# Altium schematic sheet main.SchDoc
size OrCAD A; DrawnBy: Van Tuan Ngo; Organization: PIF Club; Address1: HCMUT,; Address2: Ly Thuong Kiet St.,; Address3: District 10, HCM, VN; DocumentNumber: 1; Revision: 1.0.0; SheetNumber: 1; SheetTotal: 4; Project: RTLS
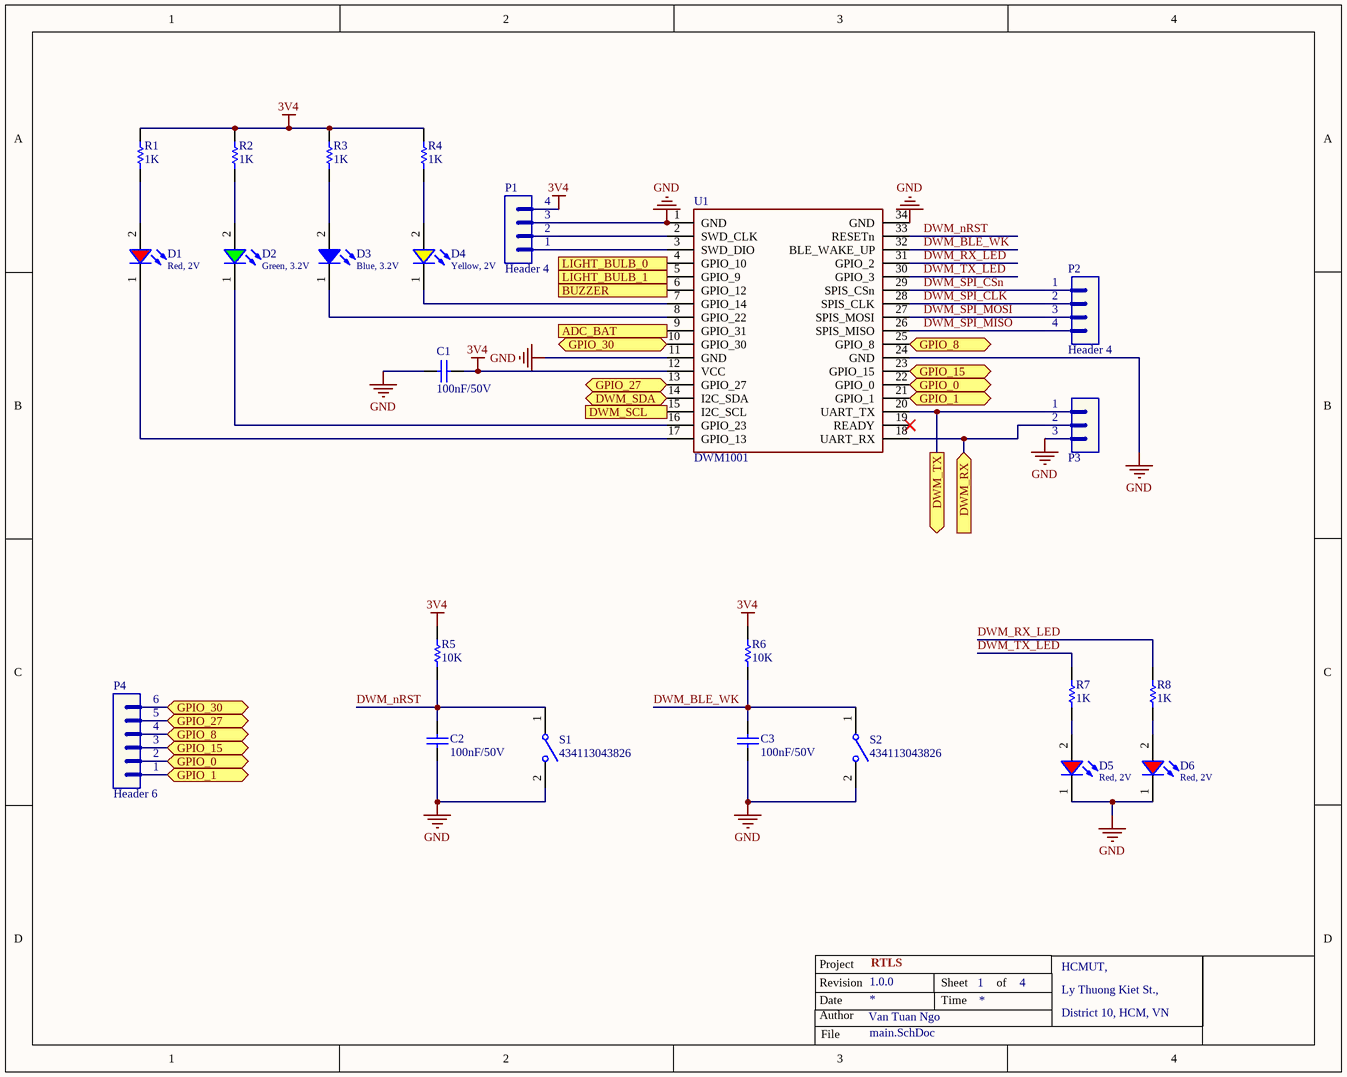
[diagram p0: main.SchDoc]

## Parts
C1  value 100nF/50V  [CAP-SM-0805]  (hidden comment: Cap-100nF-50V-0805)
C2  value 100nF/50V  [CAP-SM-0805]  (hidden comment: Cap-100nF-50V-0805)
C3  value 100nF/50V  [CAP-SM-0805]  (hidden comment: Cap-100nF-50V-0805)
D1  Red, 2V  [WL-SMCW_0805]
D2  Green, 3.2V  [WL-SMCW_0805]
D3  Blue, 3.2V  [WL-SMCW_0805]
D4  Yellow, 2V  [WL-SMCW_0805]
D5  Red, 2V  [WL-SMCW_0805]
D6  Red, 2V  [WL-SMCW_0805]
P1  Header 4  [JP4]
P2  Header 4  [JP4]
P3  Header 3  [JP3]  (value not drawn)
P4  Header 6  [JP6]
R1  value 1K  [RES-SM-0805]  (hidden comment: Res-1K-0805)
R2  value 1K  [RES-SM-0805]  (hidden comment: Res-1K-0805)
R3  value 1K  [RES-SM-0805]  (hidden comment: Res-1K-0805)
R4  value 1K  [RES-SM-0805]  (hidden comment: Res-1K-0805)
R5  value 10K  [RES-SM-0805]  (hidden comment: Res-10k-0805)
R6  value 10K  [RES-SM-0805]  (hidden comment: Res-10k-0805)
R7  value 1K  [RES-SM-0805]  (hidden comment: Res-1K-0805)
R8  value 1K  [RES-SM-0805]  (hidden comment: Res-1K-0805)
S1  434113043826  [434113043826]
S2  434113043826  [434113043826]
U1  DWM1001  [DWM1001]

## Ports
ADC_BAT (in), BUZZER (out), DWM_RX (in), DWM_SCL (out), DWM_SDA (bidir), DWM_TX (out), GPIO_0 (bidir), GPIO_1 (bidir), GPIO_8 (bidir), GPIO_15 (bidir), GPIO_27 (bidir), GPIO_30 (bidir), LIGHT_BULB_0 (out), LIGHT_BULB_1 (out)

## Nets
3V4: C1.2 P1.4 R1.1 R2.1 R3.1 R4.1 R5.2 R6.2 U1.12(VCC)
GND: C1.1 C2.1 C3.1 D5.1(K) D6.1(K) P1.3 P3.3 S1.2 S2.2 U1.1(GND) U1.11(GND) U1.24(GND) U1.34(GND)
ADC_BAT: U1.9(GPIO_31) ; port ADC_BAT
BUZZER: U1.6(GPIO_12) ; port BUZZER
DWM_BLE_WK: C3.2 R6.1 S2.1 U1.32(BLE_WAKE_UP)
DWM_nRST: C2.2 R5.1 S1.1 U1.33(RESETn)
DWM_RX: P3.2 U1.18(UART_RX) ; port DWM_RX
DWM_RX_LED: R8.1 U1.31(GPIO_2)
DWM_SCL: U1.15(I2C_SCL) ; port DWM_SCL
DWM_SDA: U1.14(I2C_SDA) ; port DWM_SDA
DWM_SPI_CLK: P2.2 U1.28(SPIS_CLK)
DWM_SPI_CSn: P2.1 U1.29(SPIS_CSn)
DWM_SPI_MISO: P2.4 U1.26(SPIS_MISO)
DWM_SPI_MOSI: P2.3 U1.27(SPIS_MOSI)
DWM_TX: P3.1 U1.20(UART_TX) ; port DWM_TX
DWM_TX_LED: R7.1 U1.30(GPIO_3)
GPIO_0: P4.2 U1.22(GPIO_0) ; port GPIO_0
GPIO_1: P4.1 U1.21(GPIO_1) ; port GPIO_1
GPIO_8: P4.4 U1.25(GPIO_8) ; port GPIO_8
GPIO_15: P4.3 U1.23(GPIO_15) ; port GPIO_15
GPIO_27: P4.5 U1.13(GPIO_27) ; port GPIO_27
GPIO_30: P4.6 U1.10(GPIO_30) ; port GPIO_30
LIGHT_BULB_0: U1.4(GPIO_10) ; port LIGHT_BULB_0
LIGHT_BULB_1: U1.5(GPIO_9) ; port LIGHT_BULB_1
NetD1_1: D1.1(K) U1.17(GPIO_13)
NetD1_2: D1.2(A) R1.2
NetD2_1: D2.1(K) U1.16(GPIO_23)
NetD2_2: D2.2(A) R2.2
NetD3_1: D3.1(K) U1.8(GPIO_22)
NetD3_2: D3.2(A) R3.2
NetD4_1: D4.1(K) U1.7(GPIO_14)
NetD4_2: D4.2(A) R4.2
NetD5_2: D5.2(A) R7.2
NetD6_2: D6.2(A) R8.2
NetP1_1: P1.1 U1.3(SWD_DIO)
NetP1_2: P1.2 U1.2(SWD_CLK)

Not connected (* = marked no-connect by the designer): U1 19(READY)*

## Notes on the sheet
- Project
- Revision
- Date
- Author
- Sheet
- Time
- of
- File

## Library data of the parts
C1-C3 = Cap-100nF-50V-0805: CAP CER 0.1UF 50V Y5V 0805; Manufacturer: Samsung Electro-Mechanics; Manufacturer Part Number: CL21F104ZBCNNNC; Local Supplier: thegioiic; Local Supplier Link: https://www.thegioiic.com/products/tu-gom-0805-100nf-0-1uf-50v; Supplier 1: Digikey; Supplier 1 Part Number: 1276-1007-1-ND; Supplier 1 Link: https://www.digikey.com/product-detail/en/samsung-electro-mechanics/CL21F104ZBCNNNC/1276-1007-1-ND/3889093
D1 D5 D6 = 150080RS75000: WL-SMCW SMT Mono-color Chip LED Waterclear, size 0805, Red, 2V, 140deg; Chip Technology: AlInGaP; Dominant Wavelength typ.: 625nm; Luminous Intensity typ.: 150mcd; Peak Wavelength typ.: 630nm; Viewing Angle: 140deg; ComponentLink1Description: Manufacturer; ComponentLink1URL: http://www.we-online.de; ComponentLink2URL: https://www.we-online.com/catalog/datasheet/150080RS75000.pdf; ComponentLink2Description: Datasheet; Forward Voltage typ.: 2V; Emitting Color: Red; Mounting Technology: SMT; Operating Temperature: -40 to +85degC; Published Date: December 2019; Part Number: 150080RS75000; Packaging: Tape and Reel; Size: 0805; Publisher: Wurth Elektronik
D2 = 150080GS75000: WL-SMCW SMT Mono-color Chip LED Waterclear, size 0805, Green, 3.2V, 140deg; Chip Technology: InGaN; Dominant Wavelength typ.: 525nm; Luminous Intensity typ.: 450mcd; Peak Wavelength typ.: 515nm; Viewing Angle: 140deg; ComponentLink1Description: Manufacturer; ComponentLink1URL: http://www.we-online.de; ComponentLink2URL: https://www.we-online.com/catalog/datasheet/150080GS75000.pdf; ComponentLink2Description: Datasheet; Forward Voltage typ.: 3.2V; Emitting Color: Green; Mounting Technology: SMT; Operating Temperature: -40 to +85degC; Published Date: December 2019; Part Number: 150080GS75000; Packaging: Tape and Reel; Size: 0805; Publisher: Wurth Elektronik
D3 = 150080BS75000: WL-SMCW SMT Mono-color Chip LED Waterclear, size 0805, Blue, 3.2V, 140deg; Chip Technology: InGaN; Dominant Wavelength typ.: 470nm; Luminous Intensity typ.: 145mcd; Peak Wavelength typ.: 465nm; Viewing Angle: 140deg; ComponentLink1Description: Manufacturer; ComponentLink1URL: http://www.we-online.de; ComponentLink2URL: https://www.we-online.com/catalog/datasheet/150080BS75000.pdf; ComponentLink2Description: Datasheet; Forward Voltage typ.: 3.2V; Emitting Color: Blue; Mounting Technology: SMT; Operating Temperature: -40 to +85degC; Published Date: December 2019; Part Number: 150080BS75000; Packaging: Tape and Reel; Size: 0805; Publisher: Wurth Elektronik
D4 = 150080YS75000: WL-SMCW SMT Mono-color Chip LED Waterclear, size 0805, Yellow, 2V, 140deg; Chip Technology: AlInGaP; Dominant Wavelength typ.: 590nm; Luminous Intensity typ.: 120mcd; Peak Wavelength typ.: 595nm; Viewing Angle: 140deg; ComponentLink1Description: Manufacturer; ComponentLink1URL: http://www.we-online.de; ComponentLink2URL: https://www.we-online.com/catalog/datasheet/150080YS75000.pdf; ComponentLink2Description: Datasheet; Forward Voltage typ.: 2V; Emitting Color: Yellow; Mounting Technology: SMT; Operating Temperature: -40 to +85degC; Published Date: December 2019; Part Number: 150080YS75000; Packaging: Tape and Reel; Size: 0805; Publisher: Wurth Elektronik
P1 P2 = Header 4: Header, 4-Pin; LatestRevisionDate: 17-Jul-2002; LatestRevisionNote: Re-released for DXP Platform.; Publisher: Altium Limited; Local Supplier: thegioiic; Local Supplier Part Number: x; Local Supplier Link: https://www.thegioiic.com/products/hang-rao-duc-don-2-54mm-40-chan-1-hang-cao-11-4mm-xuyen-lo
P3 = Header 3: Header, 3-Pin; LatestRevisionDate: 17-Jul-2002; LatestRevisionNote: Re-released for DXP Platform.; Publisher: Altium Limited; Local Supplier: thegioiic; Local Supplier Part Number: x; Local Supplier Link: https://www.thegioiic.com/products/hang-rao-duc-don-2-54mm-40-chan-1-hang-cao-11-4mm-xuyen-lo
P4 = Header 6: Header, 6-Pin; LatestRevisionDate: 17-Jul-2002; LatestRevisionNote: Re-released for DXP Platform.; Publisher: Altium Limited; Local Supplier Link: https://www.thegioiic.com/products/hang-rao-duc-don-2-54mm-40-chan-1-hang-cao-11-4mm-xuyen-lo; Local Supplier: thegioiic; Local Supplier Part Number: x
R1-R4 R7 R8 = Res-1K-0805: RES 1K OHM 1% 1/4W 0805; Manufacturer: Stackpole Electronics Inc; Manufacturer Part Number: RNCP0805FTD1K00; Local Supplier: thegioiic; Local Supplier Link: https://www.thegioiic.com/products/dien-tro-1-kohm-0805-5; Supplier 1: Digikey; Supplier 1 Link: https://www.digikey.com/product-detail/en/stackpole-electronics-inc/RNCP0805FTD1K00/RNCP0805FTD1K00CT-ND/2240568; Supplier 1 Part Number: RNCP0805FTD1K00CT-ND
R5 R6 = Res-10k-0805: RES 10K OHM 1% 1/4W 0805; Manufacturer: Stackpole Electronics Inc; Manufacturer Part Number: RNCP0805FTD10K0; Local Supplier: thegioiic; Local Supplier Link: https://www.thegioiic.com/products/dien-tro-10-kohm-0805-5; Supplier 1: Digikey; Supplier 1 Link: https://www.digikey.com/product-detail/en/stackpole-electronics-inc/RNCP0805FTD10K0/RNCP0805FTD10K0CT-ND/2240601; Supplier 1 Part Number: RNCP0805FTD10K0CT-ND
S1 S2 = 434113043826: WS-TASV J-Bend SMT Tact Switch 6x3.5mm, height 4.3mm, 260gf; Rated Voltage: 12VDC; Rated Current: 50mA; Washable: No; ComponentLink1Description: Manufacturer; ComponentLink1URL: http://www.we-online.de; ComponentLink2Description: Datasheet; ComponentLink2URL: https://katalog.we-online.com/em/datasheet/434113043826.pdf; Operating Temperature: -40 to +85degC; Part Number: 434113043826; Published Date: September 2019; Contact Material: Stainless Steel; Height: 4.3mm; Mounting Technology: SMT; Contact Plating: Silver; Operation Force: 260gf; Packaging: Tape and Reel; Terminal Material: Copper Alloy; Publisher: Wurth Elektronik; Terminal Plating: Silver; Local Supplier: thegioiic; Local Supplier Link: https://www.thegioiic.com/products/nut-nhan-3-5x6mm-cao-5mm-2-chan-smd-dau-trang; Local Supplier Part Number: x
U1 = DWM1001: Local Supplier: x; Local Supplier Part Number: x; Local Supplier Link: x